# EAGLE design FEU2 (EAGLE 6.1)
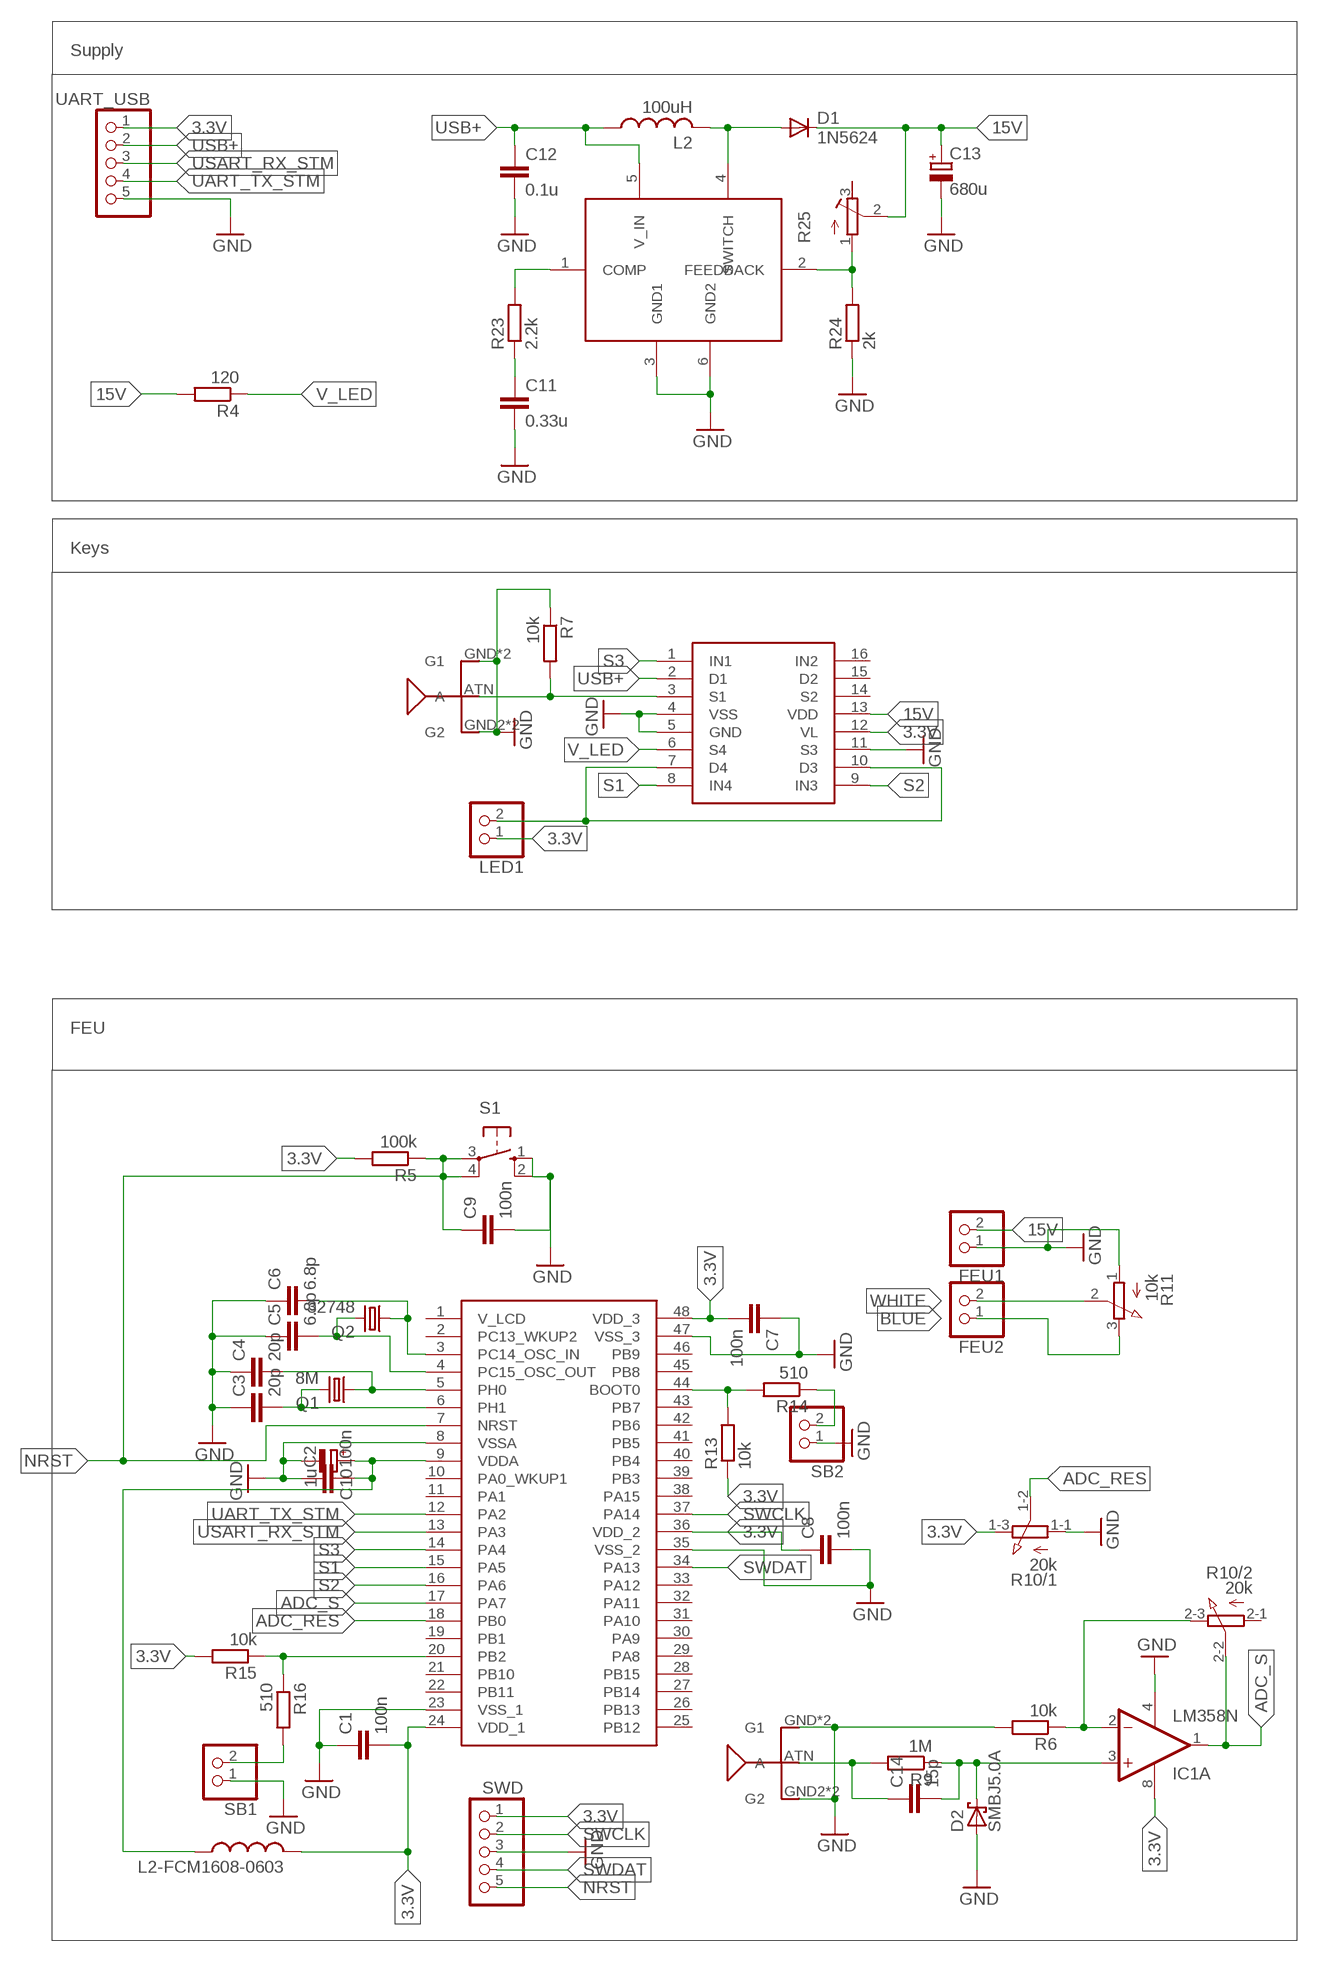
[diagram p0: schematic, sheet 1]

## Parts
C1  100n  C-EUC0805  [C0805]
C2  100n  C-EUC0805  [C0805]
C3  20p  C-EUC0805  [C0805]
C4  20p  C-EUC0805  [C0805]
C5  6.8p  C-EUC0805  [C0805]
C6  6.8p  C-EUC0805  [C0805]
C7  100n  C-EUC0805  [C0805]
C8  100n  C-EUC0805  [C0805]
C9  100n  C-EUC0805  [C0805]
C10  1u  CPOL-EUA/3216-18W  [A/3216-18W]
C11  0.33u  C-EUC0805  [C0805]
C12  0.1u  C-EUC0805  [C0805]
C13  680u  CPOL-EUE5-5  [E5-5]
C14  15p  C-EUC0805  [C0805]
D1  1N5624  [DO201-15]
D2  SMBJ5.0A  1N5908  [C4111-15]
FEU1  PINHD-1X2  [1X02]
FEU2  PINHD-1X2  [1X02]
IC1  LM358N  [DIL08]
L2  100uH  L-US0207/5V  [0207/5V]
L2-FCM1608-0603  L-USL3216C  [L3216C]
LED1  PINHD-1X2  [1X02]
Q1  8M  CRYSTALHC49S  [HC49/S]
Q2  32748  CRYSTALTC26H  [TC26H]
R4  120  R-EU_R0805  [R0805]
R5  100k  R-EU_R0805  [R0805]
R6  10k  R-EU_M1206  [M1206]
R7  10k  R-EU_R0805  [R0805]
R9  1M  R-EU_M1206  [M1206]
R10  20k  3RP/1610G  [3RP/1610G]
R11  10k  3RP/1610N  [3RP/1610N]
R13  10k  R-EU_R0805  [R0805]
R14  510  R-EU_R0805  [R0805]
R15  10k  R-EU_R0805  [R0805]
R16  510  R-EU_R0805  [R0805]
R23  2.2k  R-EU_R0805  [R0805]
R24  2k  R-EU_R0805  [R0805]
R25  R-TRIMM3339P  [RTRIM3339P]
S1  10-XX  [B3F-10XX]
SB1  PINHD-1X2  [1X02]
SB2  PINHD-1X2  [1X02]
SWD  PINHD-1X5  [1X05]
U$1  STM32L152C6  [LQFP48]
U$2  GSM_ANT  [GSM]
U$3  GSM_ANT  [GSM]
U$4  LM2577  [TO263-5]
U$5  ADG433BN  [DIL16]
UART_USB  PINHD-1X5  [1X05]

## Nets
3.3V: C1.2 C7.2 C8.1 IC1.8(P:V+) L2-FCM1608-0603.2 LED1.1 R5.2 R10.1-3(/1:E) R13.1 R15.2 SWD.1 U$1.24(VDD_1) U$1.36(VDD_2) U$1.48(VDD_3) U$5.12(VL) UART_USB.1
15V: C13.+ D1.C FEU1.2 R4.2 R25.2(S) U$5.13(VDD)
ADC_RES: R10.1-2(/1:S) U$1.18(PB0)
ADC_S: IC1.1(A:OUT) R10.2-2(/2:S) U$1.17(PA7)
BLUE: FEU2.1 R11.3(E)
GND: C1.1 C2.1 C3.1 C4.1 C5.1 C6.1 C7.1 C8.2 C9.2 C10.- C11.2 C12.2 C13.- D2.A FEU1.1 IC1.4(P:V-) R6.2 R7.1 R10.1-1(/1:A) R11.1(A) R24.1 S1.1(S) S1.2(S1) SB1.1 SB2.1 SWD.3 U$1.8(VSSA) U$1.23(VSS_1) U$1.35(VSS_2) U$1.47(VSS_3) U$2.GND1(G1) U$2.GND2(G2) U$2.GND3(G2) U$2.GND(G1) U$3.GND1(G1) U$3.GND2(G2) U$3.GND3(G2) U$3.GND(G1) U$4.3(GND1) U$4.6(GND2) U$5.4(VSS) U$5.5(GND) U$5.11(S3) UART_USB.5
N$1: C4.2 Q1.1 U$1.5(PH0)
N$2: C3.2 Q1.2 U$1.6(PH1)
N$3: C14.2 D2.C IC1.3(A:+IN) R9.1
N$4: LED1.2 U$5.7(D4) U$5.10(D3)
N$5: IC1.2(A:-IN) R6.1 R10.2-3(/2:E)
N$7: C14.1 R9.2 U$2.ATN(A)
N$13: C5.2 Q2.2 U$1.4(PC15_OSC_OUT)
N$14: C6.2 Q2.1 U$1.3(PC14_OSC_IN)
N$15: C2.2 C10.+ L2-FCM1608-0603.1 U$1.9(VDDA)
N$16: R13.2 R14.2 U$1.44(BOOT0)
N$17: R16.2 SB1.2
N$18: R14.1 SB2.2
N$19: R15.1 R16.1 U$1.20(PB2)
N$23: R7.2 U$3.ATN(A) U$5.3(S1)
N$26: R23.2 U$4.1(COMP)
N$27: C11.1 R23.1
N$28: R24.2 R25.1(E) U$4.2(FEEDBACK)
N$31: D1.A L2.2 U$4.4(SWITCH)
NRST: C9.1 R5.1 S1.3(P) S1.4(P1) SWD.5 U$1.7(NRST)
S1: U$1.15(PA5) U$5.8(IN4)
S2: U$1.16(PA6) U$5.9(IN3)
S3: U$1.14(PA4) U$5.1(IN1)
SWCLK: SWD.2 U$1.37(PA14)
SWDAT: SWD.4 U$1.34(PA13)
UART_TX_STM: U$1.12(PA2) UART_USB.4
USART_RX_STM: U$1.13(PA3) UART_USB.3
USB+: C12.1 L2.1 U$4.5(V_IN) U$5.2(D1) UART_USB.2
V_LED: R4.1 U$5.6(S4)
WHITE: FEU2.2 R11.2(S)
Unconnected: IC1.5(B:+IN) IC1.6(B:-IN) IC1.7(B:OUT) R10.2-1(/2:A) R25.3(A) U$1.1(V_LCD) U$1.2(PC13_WKUP2) U$1.10(PA0_WKUP1) U$1.11(PA1) U$1.19(PB1) U$1.21(PB10) U$1.22(PB11) U$1.25(PB12) U$1.26(PB13) U$1.27(PB14) U$1.28(PB15) U$1.29(PA8) U$1.30(PA9) U$1.31(PA10) U$1.32(PA11) U$1.33(PA12) U$1.38(PA15) U$1.39(PB3) U$1.40(PB4) U$1.41(PB5) U$1.42(PB6) U$1.43(PB7) U$1.45(PB8) U$1.46(PB9) U$5.14(S2) U$5.15(D2) U$5.16(IN2)

## Notes on the sheet
- Supply
- Keys
- FEU

## Library data of the parts
C1-C9 C11 C12 C14 = resistor:C-EU: CAPACITOR, European symbol
C10 C13 = resistor:CPOL-EU: POLARIZED CAPACITOR, European symbol
D1 = diode:1N5624: DIODE controlled avalanche rectifier
D2 = diode:1N5908: DIODE schottky
FEU1 FEU2 LED1 SB1 SB2 = pinhead:PINHD-1X2: PIN HEADER
IC1 = linear:LM358: OP AMP also LM158; LM258; LM2904 Source: http://cache.national.com/ds/LM/LM158.pdf
L2 L2-FCM1608-0603 = resistor:L-US: INDUCTOR, American symbol
Q1 = crystal:CRYSTAL: CRYSTAL; OC_FARNELL: 1667008; OC_NEWARK: unknown
Q2 = crystal:CRYSTAL: CRYSTAL; OC_FARNELL: unknown; OC_NEWARK: unknown
R4-R7 R9 R13-R16 R23 R24 = resistor:R-EU_: RESISTOR, European symbol
R10 = pot:3RP/1610G: 16mm Potentiometer two level Source: http://www.alphapotentiometers.net/html/16mm_pot_2.html
R11 = pot:3RP/1610N: 16mm Potentiometer one level Source: http://www.alphapotentiometers.net/html/16mm_pot_2.html
R25 = resistor:R-TRIMM: Trimm resistor
S1 = switch-omron:10-XX: OMRON SWITCH; MPN: B3F-1000; OC_FARNELL: 176432; OC_NEWARK: 36M3542
SWD UART_USB = pinhead:PINHD-1X5: PIN HEADER
U$1 = STM32L152:STM32L152C6
U$2 U$3 = discrete:GSM_ANT
U$4 = LM2577:LM2577
U$5 = ADG433:ADG433BN

## Board
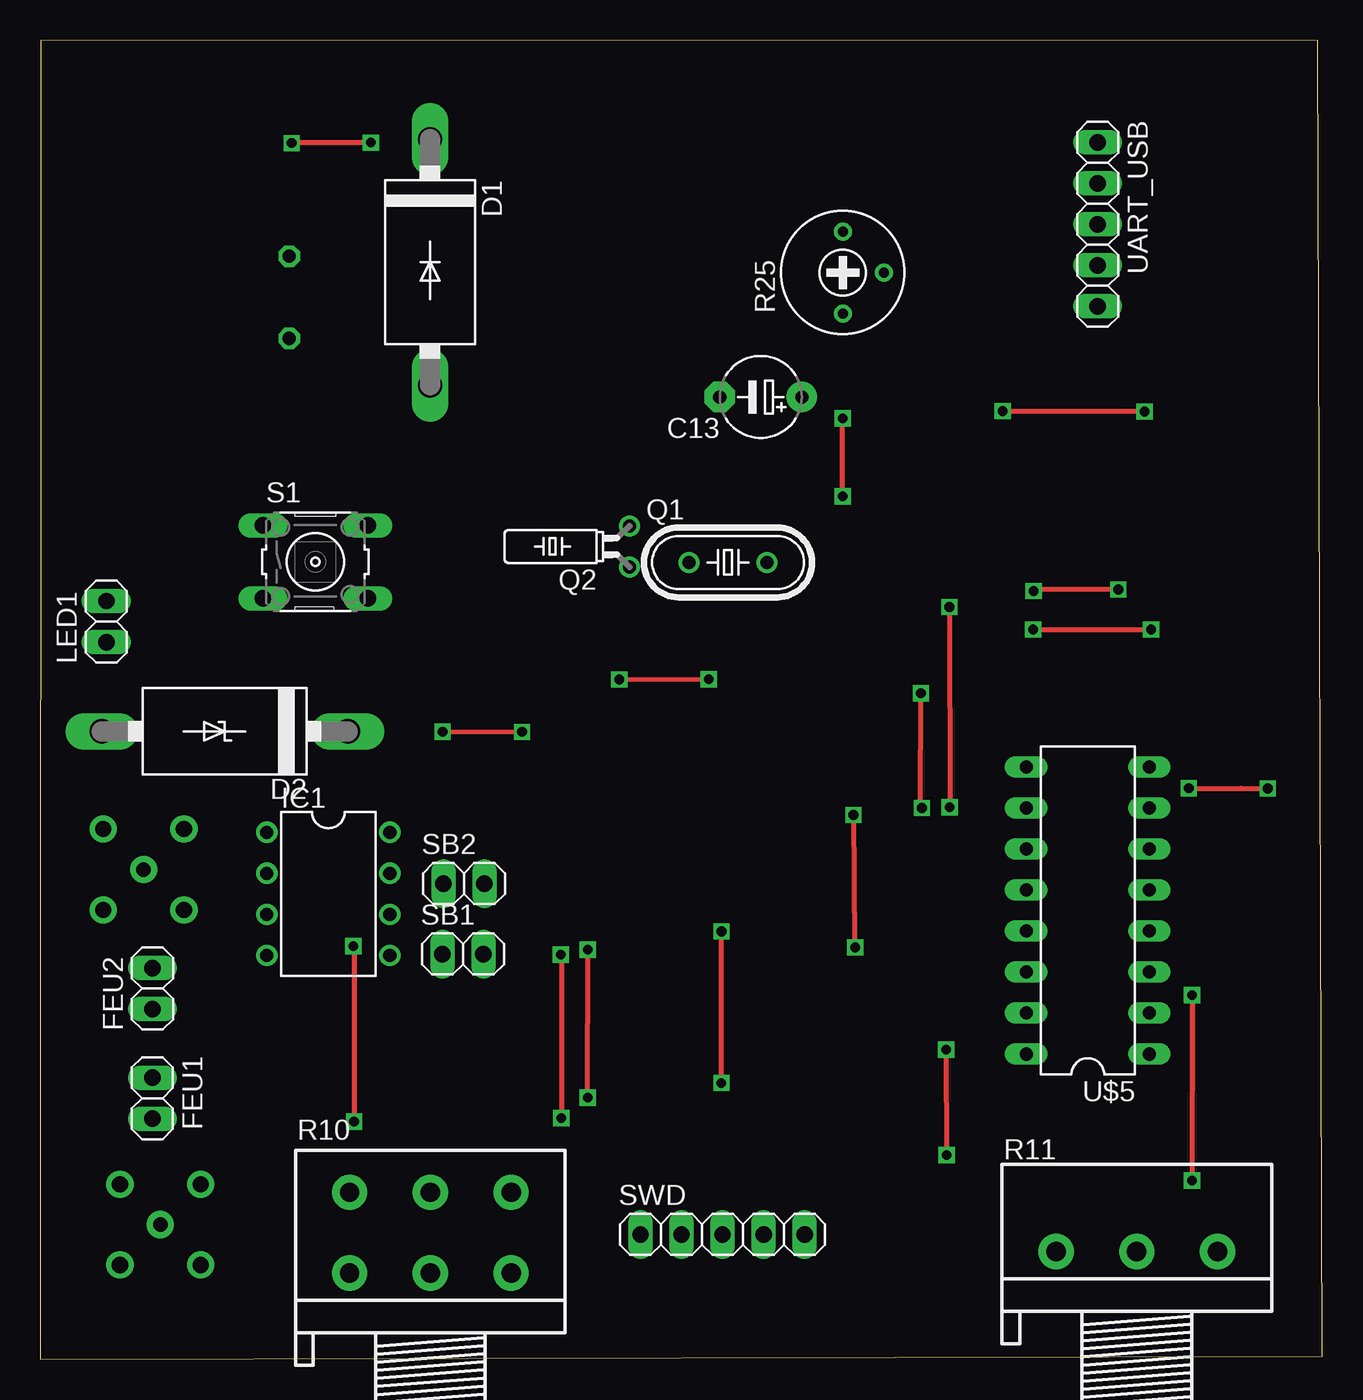
[diagram p1: board, top side]
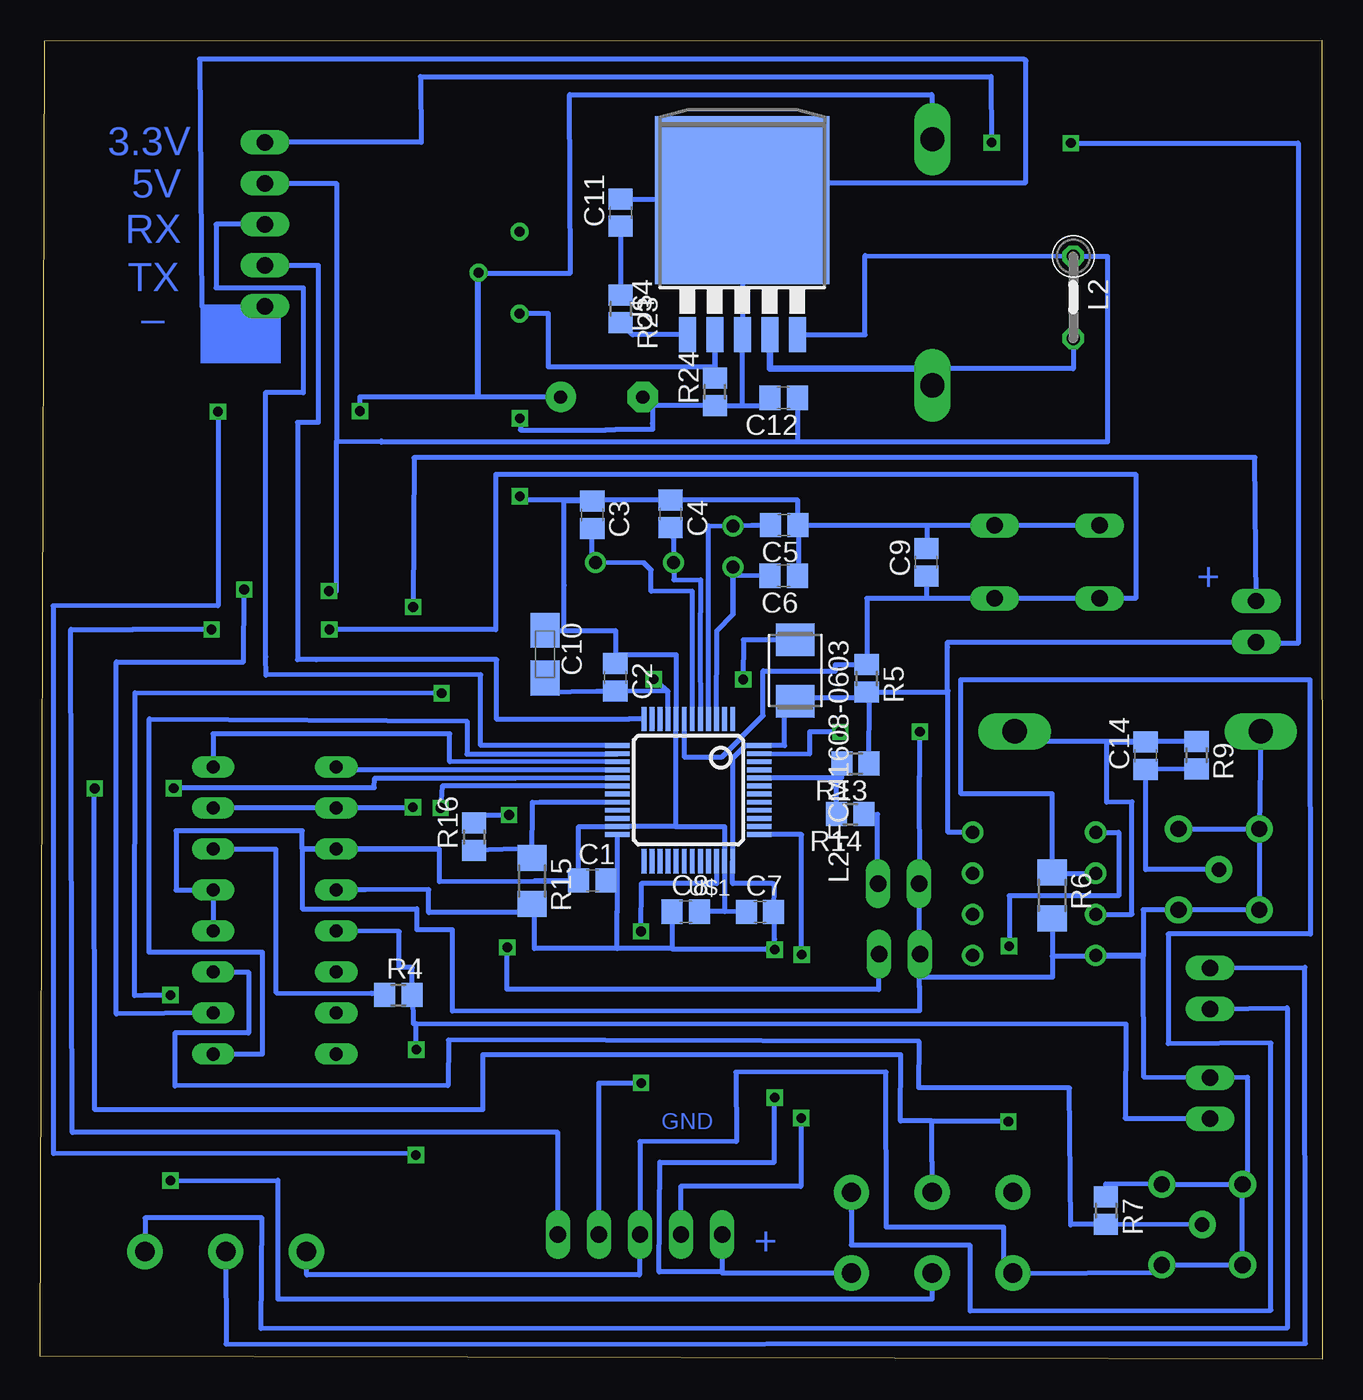
[diagram p2: board, bottom side, seen from below]

Size 79.37 x 81.66 mm. Coordinates in mm from the lower left corner, seen from the top.
Outline: 0,0 79.37,0.18 79.1,81.64 0.02,81.66 0,0
Copper layers (1*16): Top 0.035mm / dielectric 1.5mm / Bottom 0.035mm
Design rules: minimum track width 10mil, minimum drill 24mil, track to track 8mil, track to pad 8mil, pad to pad 8mil, via to via 8mil, smd to smd 8mil, copper to edge 40mil, drill to drill 8mil, minimum pad ring 10mil, minimum via ring 8mil, stop-mask expansion 4mil, vias tented up to drill 0mil, thermal gap 10mil

### Footprints (pad centres in the part's own frame; a part is rotated, then mirrored left to right if it is on the bottom)
C0805 = smd 1.3 x 1.5: 1 -0.85,0; 2 0.85,0
A/3216-18W = smd 2.15 x 1.8: + 1.475,0; - -1.475,0
E5-5 = drill 0.813 pad 1.905: + -2.54,0 | drill 0.813 pad 1.905 octagon: - 2.54,0
DO201-15 = drill 1.499 long: A 7.62,0; C -7.62,0
C4111-15 = drill 1.499 long: A 7.62,0; C -7.62,0
1X02 = drill 1.016 long: 1 -1.27,0; 2 1.27,0
DIL08 = drill 0.813 pad 1.27: 1 -3.81,-3.81; 2 -1.27,-3.81; 3 1.27,-3.81; 4 3.81,-3.81; 5 3.81,3.81; 6 1.27,3.81; 7 -1.27,3.81; 8 -3.81,3.81
0207/5V = drill 0.813 octagon: 1 -2.54,0; 2 2.54,0
L4532M = smd 2 x 2.4: 1 -1.9,0; 2 1.9,0
HC49/S = drill 0.813: 1 -2.413,0; 2 2.413,0
TC26H = drill 0.813: 1 -1.27,0; 2 1.27,0
R0805 = smd 1.3 x 1.5: 1 -0.85,0; 2 0.85,0
R1206 = smd 1.6 x 1.803: 1 -1.422,0; 2 1.422,0
3RP/1610G = drill 1.2 pad 2.184: 1-1 -5,0; 1-2 0,0; 1-3 5,0; 2-1 -5,5; 2-2 0,5; 2-3 5,5
3RP/1610N = drill 1.2 pad 2.184: 1 -5,0; 2 0,0; 3 5,0
RTRIM3339P = drill 0.61: 1 -2.54,0; 2 0,-2.54; 3 2.54,0
B3F-10XX = drill 1.016 long: 1 -3.251,2.261; 2 3.251,2.261; 3 -3.251,-2.261; 4 3.251,-2.261
1X05 = drill 1.016 long: 1 -5.08,0; 2 -2.54,0; 3 0,0; 4 2.54,0; 5 5.08,0
LQFP48 = smd 0.3 x 1.5: 1 -2.75,-4.4; 2 -2.25,-4.4; 3 -1.75,-4.4; 4 -1.25,-4.4; 5 -0.75,-4.4; 6 -0.25,-4.4; 7 0.25,-4.4; 8 0.75,-4.4; 9 1.25,-4.4; 10 1.75,-4.4; 11 2.25,-4.4; 12 2.75,-4.4; 25 2.75,4.4; 26 2.25,4.4; 27 1.75,4.4; 28 1.25,4.4; 29 0.75,4.4; 30 0.25,4.4; 31 -0.25,4.4; 32 -0.75,4.4; 33 -1.25,4.4; 34 -1.75,4.4; 35 -2.25,4.4; 36 -2.75,4.4 | smd 1.5 x 0.3: 13 4.4,-2.75; 14 4.4,-2.25; 15 4.4,-1.75; 16 4.4,-1.25; 17 4.4,-0.75; 18 4.4,-0.25; 19 4.4,0.25; 20 4.4,0.75; 21 4.4,1.25; 22 4.4,1.75; 23 4.4,2.25; 24 4.4,2.75; 37 -4.4,2.75; 38 -4.4,2.25; 39 -4.4,1.75; 40 -4.4,1.25; 41 -4.4,0.75; 42 -4.4,0.25; 43 -4.4,-0.25; 44 -4.4,-0.75; 45 -4.4,-1.25; 46 -4.4,-1.75; 47 -4.4,-2.25; 48 -4.4,-2.75
GSM = drill 0.9 pad 1.676: ATN 0,0 | drill 1 pad 1.676: GND -2.5,2.5; GND1 -2.5,-2.5; GND2 2.5,-2.5; GND3 2.5,2.5
TO263-5 = smd 1.067 x 2.159: 1 -3.404,-7.061; 2 -1.702,-7.061; 3 0,-7.061; 4 1.702,-7.061; 5 3.404,-7.061 | smd 10.8 x 10.41: 6 0,1.27
DIL16 = drill 0.813 long: 1 -7.62,-3.81; 2 -5.08,-3.81; 3 -2.54,-3.81; 4 0,-3.81; 5 2.54,-3.81; 6 5.08,-3.81; 7 7.62,-3.81; 8 10.16,-3.81; 9 10.16,3.81; 10 7.62,3.81; 11 5.08,3.81; 12 2.54,3.81; 13 0,3.81; 14 -2.54,3.81; 15 -5.08,3.81; 16 -7.62,3.81

### Placement (x,y rotation side)
C1  45.18,29.64 0 bottom
C2  43.77,42.23 270 bottom
C3  45.2,52.28 270 bottom
C4  40.35,52.33 270 bottom
C5  33.32,51.65 180 bottom
C6  33.34,48.51 180 bottom
C7  34.81,27.69 0 bottom
C8  39.41,27.71 0 bottom
C9  24.51,49.35 90 bottom
C10  48.12,43.65 270 bottom
C11  43.44,70.99 90 bottom
C12  33.34,59.52 180 bottom
C13  44.61,59.58 180 top
C14  10.93,37.37 90 bottom
D1  24.13,67.92 270 top
D2  11.42,38.88 180 top
FEU1  6.93,16.16 270 top
FEU2  6.94,22.95 90 top
IC1  17.83,28.81 270 top
L2  15.41,65.75 270 bottom
L2-FCM1608-0603  [L4532M]  32.63,42.64 270 bottom
LED1  4.08,45.67 90 top
Q1  42.58,49.33 0 top
Q2  36.48,50.32 90 top
R4  57.2,22.55 0 bottom
R5  28.2,42.15 270 bottom
R6  10k  [R1206]  16.72,28.72 270 bottom
R7  13.39,9.2 270 bottom
R9  1M  [R0805]  7.78,37.4 270 bottom
R10  24.15,5.33 0 top
R11  67.89,6.66 0 top
R13  28.9,36.88 180 bottom
R14  29.23,33.75 180 bottom
R15  10k  [R1206]  48.92,29.61 270 bottom
R16  52.51,32.34 90 bottom
R23  43.44,65.03 270 bottom
R24  37.6,59.9 90 bottom
R25  49.69,67.28 90 top
S1  17.03,49.37 0 top
SB1  26.17,25.08 0 top
SB2  26.23,29.45 0 top
SWD  42.24,7.72 0 top
U$1  39.25,35.24 180 bottom
U$2  6.39,30.32 0 top
U$3  7.43,8.33 270 top
U$4  35.9,70.49 0 bottom
U$5  64.86,26.51 90 top
UART_USB  65.47,70.27 270 top

### Tracks (layer width: path | path; a pad name or v marks a point on that pad's centre or on a via)
3.3V  (via drill 0.6)
  Top 0.305: v33.89,16.19 v33.9,25.36 | v20.47,75.33 15.56,75.33 v15.56,75.3
  Bottom 0.305: U$5.12 59.26,29.06 55.33,29.07 55.33,27.66 48.77,27.67 | U$1.24 43.65,29.64 | 43.65,29.64 43.65,27.72 | 23.21,41.3 R5.2 28.07,41.31 28.04,40.98 | R13.1 28.04,40.98 | 28.04,40.98 28.04,40.96 33.13,40.98 | 33.13,40.98 33.01,41.01 33.28,40.98 33.28,37.99 U$1.48 35.72,37.99 36.51,37.2 36.51,35.81 U$1.36 36.5,29.45 34.04,29.45 33.95,29.44 C7.2 33.98,27.59 33.91,27.65 33.91,26.01 33.9,26.01 v33.9,25.36 34.42,25.36 34.42,25.41 40.26,25.41 C8.1 | R10.1-3 37.16,5.33 37.16,5.4 | C8.1 40.27,25.41 | L2-FCM1608-0603.2 32.63,40.98 33.13,40.98 | IC1.8 23.16,32.62 23.16,41.38 23.21,41.3 | 23.21,41.3 23.19,41.3 23.2,44.07 23.19,44.39 LED1.1 4.08,44.32 1.48,44.32 1.48,75.3 v15.56,75.3 | SWD.1 37.16,5.4 | 37.16,5.4 41.05,5.4 41.01,12.19 33.92,12.2 33.92,16.19 v33.89,16.19 | R15.2 48.77,28.19 48.77,27.67 | C8.1 40.26,25.42 43.65,25.42 43.65,25.43 | 43.65,25.43 43.65,27.69 | 43.65,27.69 43.65,27.72 | 43.65,27.72 43.68,27.72 43.68,27.69 43.65,27.69 | C1.2 43.65,29.64 | 43.65,25.43 48.77,25.43 48.77,27.67 | v20.47,75.33 20.51,79.41 55.83,79.41 55.79,75.35 UART_USB.1
15V  (via drill 0.6)
  Top 0.305: v59.59,58.7 68.37,58.7 v68.37,58.67 | v56.12,12.64 56.1,19.19 v56.09,19.16
  Bottom 0.305: 52.23,59.58 R25.2 | C13.+ 52.23,59.58 | 52.23,59.58 52.31,59.58 | 52.31,59.58 52.31,67.26 46.55,67.26 46.59,78.31 24.17,78.31 D1.C | 56.09,20.77 12.15,20.73 12.2,14.93 12.18,14.89 FEU1.2 | 56.09,20.77 56.26,20.77 56.29,22.53 56.35,22.53 R4.2 56.35,24.25 57.15,24.25 57.15,26.47 U$5.13 | 52.31,59.58 59.59,59.58 v59.59,58.7 | v68.37,58.67 68.37,46.66 78.58,46.64 78.57,12.73 56.12,12.77 v56.12,12.64 | v56.09,19.16 56.09,20.77 | 56.09,20.77
ADC_RES  (via drill 0.6)
  Top 0.305: v54.59,34.13 54.5,34.26 v54.53,41.23 | v71.31,22.54 71.32,22.16 v71.31,11.05
  Bottom 0.305: R10.1-2 24.15,3.72 64.66,3.72 64.65,11.08 v71.31,11.05 | U$1.18 54.49,35.49 v54.59,34.13 | v54.53,41.23 73.52,41.25 73.55,22.52 72.91,22.54 v71.31,22.54
ADC_S  (via drill 0.6)
  Top 0.305: v19.38,25.57 19.43,25.57 v19.43,14.71 | v71.12,35.35 74.36,35.35 v76.01,35.34
  Bottom 0.305: U$1.17 58.67,35.97 | 58.67,35.97 49.96,35.98 | 58.67,35.97 58.69,35.37 71.15,35.38 v71.12,35.35 | R10.2-2 24.15,12.21 24.16,12.21 24.16,14.74 | 24.16,14.74 26.11,14.74 26.09,18.85 51.96,18.85 51.96,15.46 76.03,15.47 76.07,35.31 v76.01,35.34 | IC1.1 12.59,32.62 12.59,28.69 19.38,28.69 v19.38,25.57 | v19.43,14.71 24.15,14.71 24.16,14.74
BLUE
  Bottom 0.305: R11.3 72.89,8.74 65.65,8.74 65.7,1.89 2.17,1.92 2.16,21.75 FEU2.1
GND  (via drill 0.6)
  Top 0.305: v24.91,38.85 v29.83,38.84 | v49.68,53.43 v49.68,58.26
  Bottom 0.305: U$1.47 31.72,37.48 31.72,38.84 29.66,38.83 v29.83,38.84 | U$1.23 46.03,32.98 C1.1 | U$1.23 | U$5.5 U$5.4 | U$3.GND U$3.GND1 U$3.GND2 U$3.GND3 9.93,5.39 R10.1-1 19.71,5.33 19.71,8.17 26.99,8.17 27.01,17.78 36.3,17.76 36.28,13.46 42.24,13.48 SWD.3 42.28,5.22 62.88,5.22 R11.1 | U$3.GND 4.61,10.83 4.61,17.22 4.63,17.45 FEU1.1 11.04,17.45 11.07,24.97 13.16,24.96 | U$1.8 | C11.2 35.98,71.84 U$4.6 | U$4.6 U$4.3 35.93,63.43 35.93,59.05 | 41.46,59.05 41.54,59.05 C13.- | 35.93,59.05 R24.1 41.46,59.05 | 35.93,59.05 34.19,59.05 C12.2 | 24.94,23.64 16.73,23.64 16.74,23.69 16.71,23.69 | 40.03,32.98 37,32.98 U$1.35 37,27.71 | C4.1 45.11,53.19 C3.1 46.93,53.14 46.93,47.93 46.94,45.1 43.74,45.11 | C5.1 32.47,53.18 C4.1 | C2.1 43.76,43.63 | 43.74,45.11 43.76,43.63 | 43.76,43.63 40.01,43.63 U$1.8 | C1.1 46.03,29.61 48.76,29.62 54.67,29.59 54.67,31.56 U$5.11 63.15,31.59 63.15,32.72 70.97,32.72 70.97,29.05 U$5.5 | 24.94,23.64 24.94,24.84 | 24.94,24.84 24.94,29.46 SB2.1 24.91,29.56 24.93,36.11 24.91,36.11 v24.91,38.85 | D2.A U$2.GND | U$2.GND3 U$2.GND | U$2.GND U$2.GND1 U$2.GND2 11.08,27.82 11.08,24.99 13.08,24.99 IC1.4 13.16,24.96 | U$4.6 35.9,72.82 18.38,72.82 18.38,80.39 18.34,80.39 18.47,80.52 69.51,80.52 69.38,65.18 UART_USB.5 | 41.46,59.05 41.47,57.94 41.46,57.57 43.79,57.55 44.35,57.55 44.35,57.53 49.65,57.53 v49.68,58.26 | U$1.8 40.03,39.64 40.03,32.98 | C10.- 46.11,45.1 43.74,45.11 | U$3.GND 13.42,10.84 R7.1 | SB1.1 24.94,24.84 | 37,27.71 C8.2 | C7.1 37,27.71 | C5.1 32.42,51.73 32.42,48.41 32.5,48.41 32.5,48.49 32.49,48.49 C6.1 | U$5.5 68.6,29.05 | R6.2 16.71,24.94 | 16.71,23.69 16.69,23.67 16.7,23.66
  Bottom 0.305: S1.2 S1.1 24.43,51.63 | 24.43,51.63 32.47,51.63 C5.1 | C9.2 24.37,50.2 24.37,50.19 24.43,50.19 24.43,51.63 | 13.16,24.96 13.16,24.94 16.71,24.94 | 16.71,24.94 16.71,23.69 | 40.03,32.98 U$1.23 | C1.1 46.03,29.58 54.66,29.56 54.66,31.59 63.15,31.61 63.15,27.88 56.06,27.88 56.06,26.6 53.87,26.6 53.87,21.56 24.91,21.58 24.91,23.08 24.94,23.08 24.94,23.64 | C4.1 49.68,53.18 v49.68,53.43
N$1
  Bottom 0.305: U$1.5 38.52,44.17 38.49,48.26 40.14,48.25 Q1.1 40.17,50.84 C4.2
N$2
  Bottom 0.305: C3.2 45.21,49.34 Q1.2 41.98,49.31 41.54,48.87 41.54,47.54 39,47.55 U$1.6
N$3
  Bottom 0.305: R9.1 10.9,38.24 | 10.9,38.24 C14.2 13.34,38.2 13.34,34.48 11.78,34.51 11.78,27.54 IC1.3 | 10.9,38.24 19.06,38.24 19.06,38.45 D2.C
N$4  (via drill 0.6)
  Top 0.305: v56.29,46.57 v56.31,34.17
  Bottom 0.305: v56.31,34.17 56.3,34.12 U$5.10 U$5.7 | LED1.2 4.16,55.84 56.24,55.81 v56.29,46.57
N$5
  Bottom 0.305: R10.2-3 29.16,9.18 29.16,7.07 21.82,7.07 21.81,2.98 3.17,3.03 3.17,19.58 9.53,19.53 9.53,26.32 0.72,26.32 0.76,42.08 22.37,42.08 22.36,35.01 16.71,35.01 16.7,30.03 | IC1.2 14.17,30.04 16.7,30.03 | R6.1 16.7,30.03
N$7
  Bottom 0.305: U$2.ATN 10.93,30.32 C14.1 | R9.2 C14.1 | C14.1
N$13
  Bottom 0.305: U$1.4 37.99,51.61 Q2.2 36.34,51.62 36.42,51.63 35.32,51.64 C5.2
N$14
  Bottom 0.305: U$1.3 37.48,45.1 36.47,46.11 36.49,46.11 | 36.49,46.11 Q2.1 | C6.2 36.47,48.49 36.49,46.11
N$15  (via drill 0.6)
  Top 0.305: v35.85,42.08 v41.38,42.1
  Bottom 0.305: U$1.9 40.51,41.35 | 40.51,41.35 C2.2 43.73,41.38 44.91,41.36 48.12,41.3 C10.+ | L2-FCM1608-0603.1 35.84,44.54 v35.85,42.08 | v41.38,42.1 40.52,41.37 40.51,41.35
N$16
  Bottom 0.305: R13.2 29.76,35.99 30.07,35.99 | 30.07,35.99 U$1.44 | R14.2 30.07,35.99
N$17  (via drill 0.6)
  Top 0.305: v50.35,33.7 50.42,25.69 v50.45,25.49
  Bottom 0.305: SB1.2 27.46,22.88 50.48,22.9 50.46,25.36 v50.45,25.49 | R16.2 52.42,33.19 | 52.39,33.19 52.42,33.19 | 52.42,33.19 52.42,33.69 v50.35,33.7
N$18
  Bottom 0.305: SB2.2 27.54,29.52 27.53,33.74 R14.1
N$19
  Bottom 0.305: U$1.20 48.43,34.49 48.9,34.48 R15.1 48.93,31.61 R16.1
N$23
  Bottom 0.305: U$3.ATN R7.2 15.54,8.35 15.57,8.31 15.64,16.79 24.99,16.8 24.98,19.69 54.1,19.76 54.13,16.95 71.05,16.92 71.05,20.2 66.48,20.2 66.48,23.97 U$5.3
N$26
  Bottom 0.305: U$4.1 42.69,63.43 R23.2
N$27
  Bottom 0.305: C11.1 R23.1
N$28
  Bottom 0.305: R24.2 U$4.2 37.6,61.43 47.91,61.43 47.91,64.74 R25.1
N$31
  Bottom 0.305: L2.2 15.41,61.32 24.19,61.32
  Bottom 0.406: D1.A 24.13,61.32 24.19,61.32 34.19,61.32 U$4.4
NRST  (via drill 0.6)
  Top 0.305: v61.48,45.18 v68.77,45.18
  Bottom 0.305: U$1.7 39.5,37.3 37.15,37.3 34.61,39.84 34.61,42.61 30.14,42.6 30.14,43 R5.1 28.2,47.11 24.49,47.11 | 24.49,47.11 S1.4 S1.3 11.54,47.11 11.54,54.8 51.16,54.8 51.16,45.17 v61.48,45.18 | C9.1 24.49,48.5 24.49,47.11 | SWD.5 47.32,14.04 77.39,14.03 77.48,45.19 73.63,45.19 v68.77,45.18
S1
  Bottom 0.305: U$1.15 54.02,37 54.02,38.72 68.67,38.71 U$5.8
S2
  Bottom 0.305: U$1.16 61.05,36.49 U$5.9
S3
  Bottom 0.305: U$1.14 43.66,37.46 52.96,37.46 52.96,39.5 52.97,39.5 | U$5.1 65.61,18.89 65.61,25.2 72.64,25.2 72.62,39.65 52.97,39.5 | 52.97,39.5 52.97,39.49
SWCLK  (via drill 0.6)
  Top 0.305: v32.23,25.05 32.26,25.05 v32.26,14.93
  Bottom 0.305: v32.23,25.05 32.23,32.48 U$1.37 | v32.26,14.93 32.28,14.93 32.28,10.7 39.73,10.69 SWD.2
SWDAT  (via drill 0.6)
  Top 0.305: v42.17,17.1 42.17,26.47 v42.18,26.49
  Bottom 0.305: U$1.34 37.5,29.45 42.16,29.45 | 42.16,29.45 42.07,29.46 | SWD.4 44.78,17.1 v42.17,17.1 | v42.18,26.49 42.16,29.45
UART_TX_STM
  Bottom 0.305: U$1.12 42.93,39.63 43.02,39.61 51.11,39.61 51.11,43.31 62.29,43.32 62.27,43.31 63.45,43.31 63.45,58 62.16,58 62.16,67.73 UART_USB.4
USART_RX_STM
  Bottom 0.305: U$1.13 52.1,38.01 52.1,42.39 65.4,42.36 65.41,43.49 65.45,43.51 65.45,59.84 63.09,59.84 63.09,66.34 68.49,66.34 68.49,70.27 UART_USB.3
USB+  (via drill 0.6)
  Top 0.305: v66.75,47.65 61.36,47.65 v61.51,47.56
  Bottom 0.305: C12.1 | U$4.5 28.31,63.43 28.31,68.34 15.38,68.3 L2.1 13.27,68.28 13.27,56.81 32.49,56.81 C12.1 | C12.1 32.5,56.79 58.24,56.79 | 61.04,56.83 58.24,56.85 58.24,56.79 | 58.24,56.79 58.24,56.76 | U$5.2 74.67,21.37 74.67,43.18 66.79,43.17 v66.75,47.65 | v61.51,47.56 61.03,47.55 61.03,48.86 61.02,56.76 61.04,56.83 | UART_USB.2 61.04,72.81 61.04,56.83
V_LED
  Bottom 0.305: U$5.6 64.78,31.59 64.76,22.68 58.83,22.64 58.87,22.67 R4.1
WHITE
  Bottom 0.305: R11.2 67.87,0.93 1.04,0.97 1.07,24.27 FEU2.2
(copper drawn outside any net)
  shapes: Bottom area x1

### Text on the board
Bottom: 3.3V | 5V | RX | TX | _ | + | GND | +